# EasyEDA schematic EasyEDA_Source.json
TITLE: Clima; REV: v3.d; Date: 2023.March; Sheet: 1/1; Drawn By: Bryan Costanich; Company: Wilderness Labs
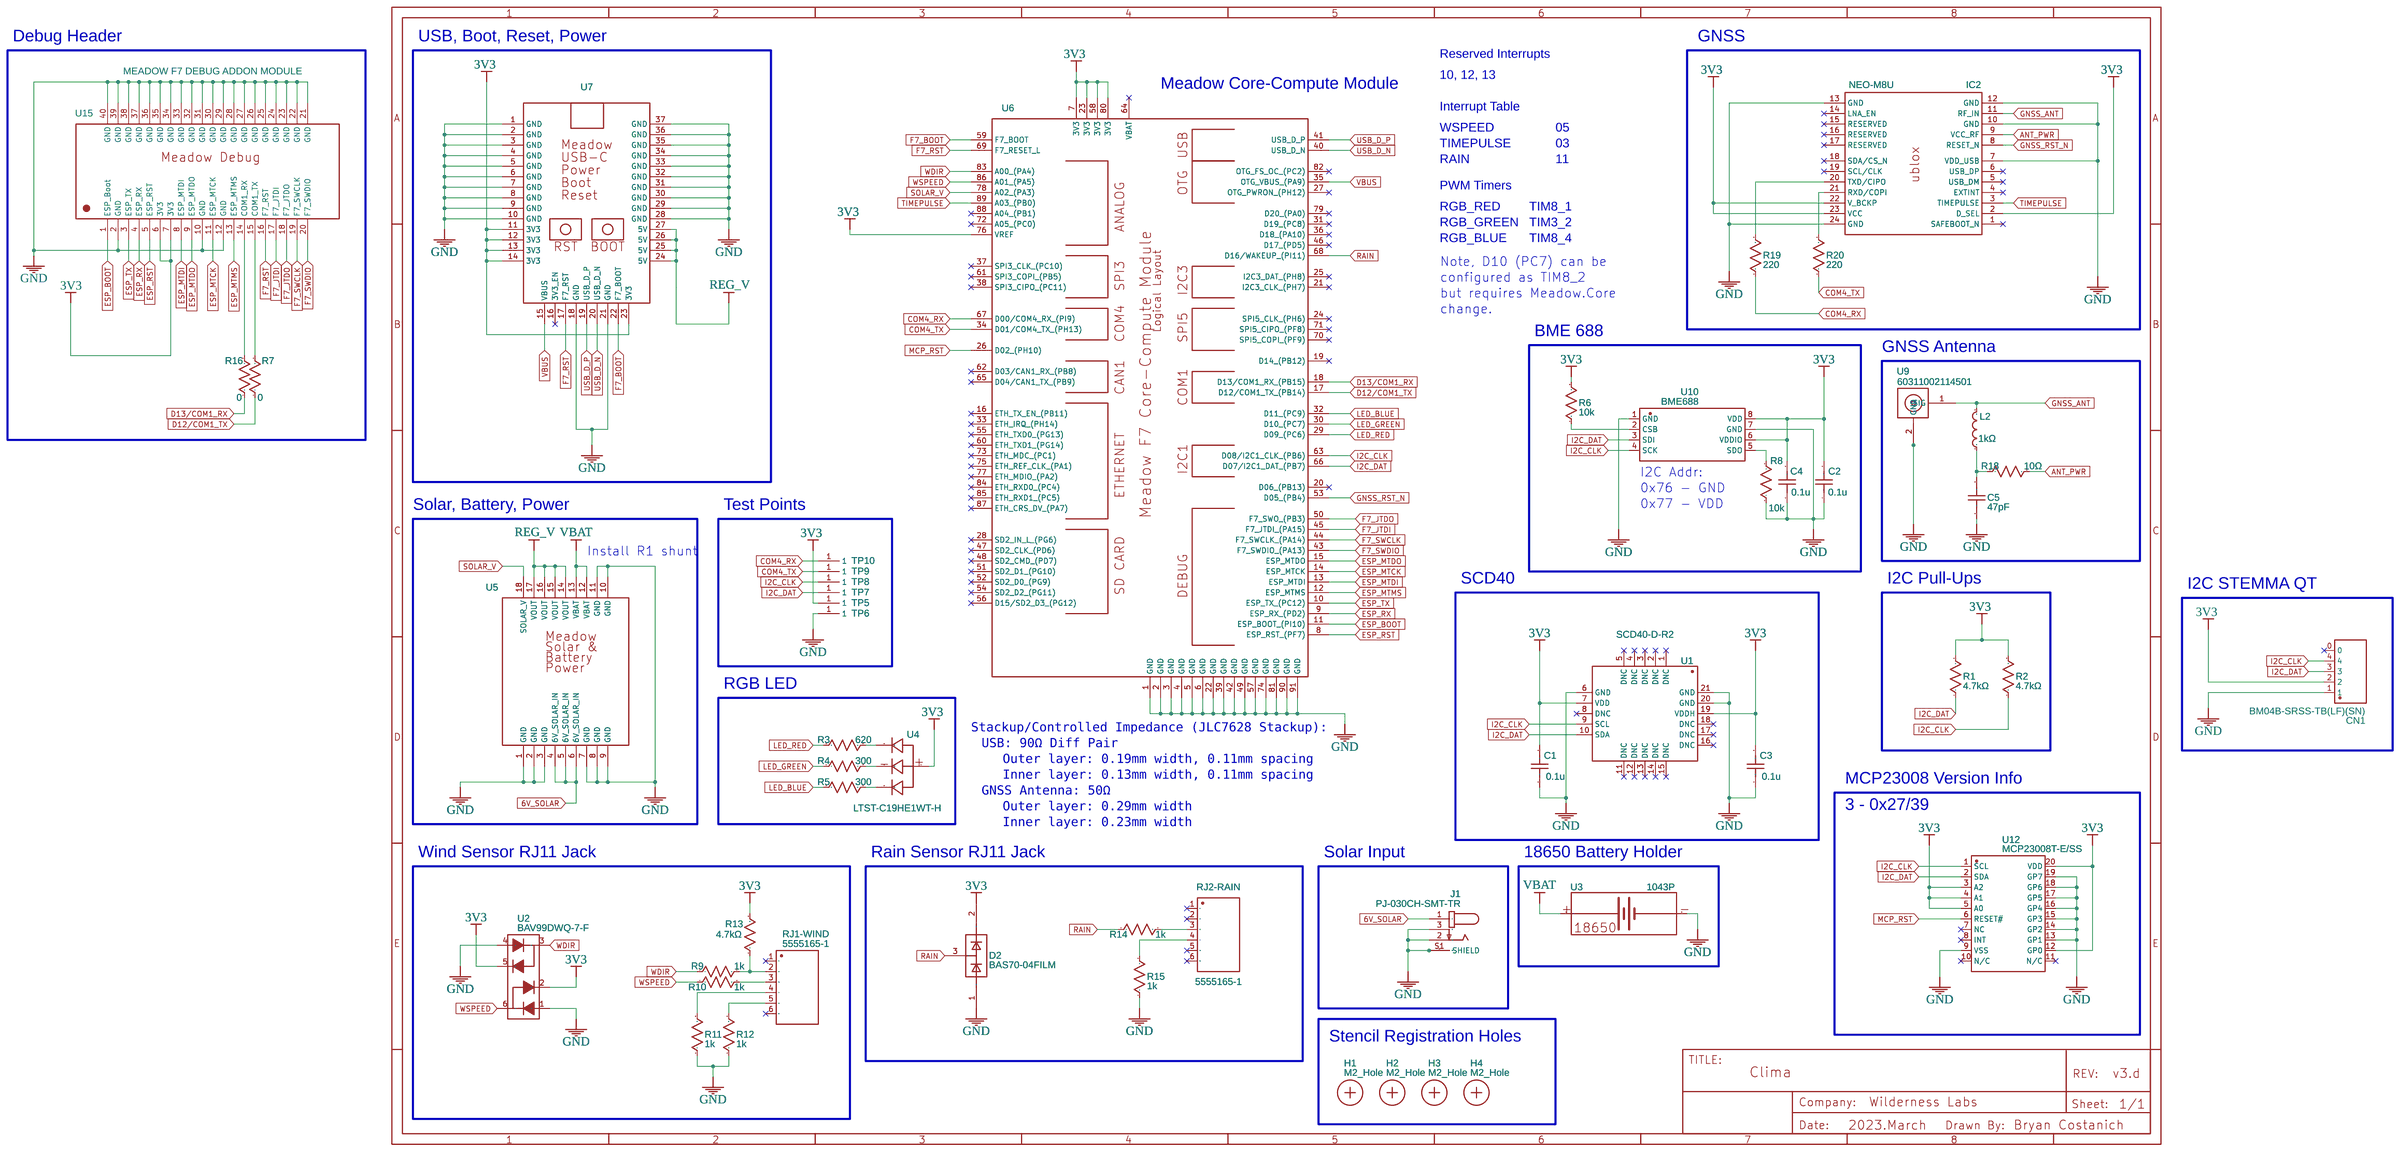
[diagram p0: schematic sheet]

## Parts
C1  0.1u  [C0603]
C2  0.1u  [C0603]
C3  0.1u  [C0603]
C4  0.1u  [C0603]
C5  47pF  [C0603]
CN1  BM04B-SRSS-TB(LF)(SN)  [CONN-SMD_BM04B-SRSS-TB]
D2  BAS70-04FILM  [SOT-23-3_L2.9-W1.3-P1.90-LS2.4-BR]
H1  M2_Hole  [M2_PASTEMASK_STENCIL_REGISTRATION_HOLE]
H2  M2_Hole  [M2_PASTEMASK_STENCIL_REGISTRATION_HOLE]
H3  M2_Hole  [M2_PASTEMASK_STENCIL_REGISTRATION_HOLE]
H4  M2_Hole  [M2_PASTEMASK_STENCIL_REGISTRATION_HOLE]
IC2  NEO-M8U  [NEO-M8U]
J1  PJ-030CH-SMT-TR  [CUI_PJ-030CH-SMT-TR]
L2  1kΩ  [L0402]
R1  4.7kΩ  [R0603]
R2  4.7kΩ  [R0603]
R3  620  [R0603]
R4  300  [R0603]
R5  300  [R0603]
R6  10k  [R0603]
R7  0  [R0603]
R8  10k  [R0603]
R9  1k  [R0603]
R10  1k  [R0603]
R11  1k  [R0603]
R12  1k  [R0603]
R13  4.7kΩ  [R0603]
R14  1k  [R0603]
R15  1k  [R0603]
R16  0  [R0603]
R18  10Ω  [R0603]
R19  220  [R0603]
R20  220  [R0603]
RJ1-WIND  5555165-1  [RJ11-TH_6P-P2.54-S2.54_L18.3-W13.4-EH10.2]
RJ2-RAIN  5555165-1  [RJ11-TH_6P-P2.54-S2.54_L18.3-W13.4-EH10.2]
TP5  TESTPAD_PTH  [TESTPAD_PTH]
TP6  TESTPAD_PTH  [TESTPAD_PTH]
TP7  TESTPAD_PTH  [TESTPAD_PTH]
TP8  TESTPAD_PTH  [TESTPAD_PTH]
TP9  TESTPAD_PTH  [TESTPAD_PTH]
TP10  TESTPAD_PTH  [TESTPAD_PTH]
U1  SCD40-D-R2  [LGA-20_L10.1-W10.1-P1.25-TL]
U2  BAV99DWQ-7-F  [SOT363 (NO POLARITY)]
U3  1043P  [BAT-TH_KEYSTONE-1043P]
U4  LTST-C19HE1WT-H  [LED-ARRAY-SMD_0603-4P-L1.6-W1.6-BL-RD]
U5  Meadow Core-Compute Addon Module - Solar Battery Power  [MEADOW CORE-COMPUTE SOLAR & BATTERY POWER ADDON MODULE]
U6  Meadow F7v2 Core-Compute Module - Logical  [MEADOW_F7V2_CORE_COMPUTE]
U7  Meadow Core-Compute USB-C, Power, Boot, and Reset Addon Module  [MEADOW CORE-COMPUTE USB-C, POWER, BOOT, RESET ADDON MODULE]
U8  WILDERNESS_LABS_LOGO_HORIZONTAL  [WILDERNESS_LABS_LOGO_HORIZONTAL]
U9  60311002114501  [SMA_60311002114501]
U10  BME688  [LGA-8_L3.0-W3.0-P0.80-TR]
U12  MCP23008T-E/SS  [SSOP-20_L7.2-W5.3-P0.65-LS7.8-TL]
U15  MEADOW F7 DEBUG ADDON MODULE  [MEADOW F7 DEBUG ADDON MODULE]

## Library data of the parts
C1-C4 = C_0402_US: Contributor: LCEDA_Lib; Manufacturer Part: CC0603KRX7R9BB103; Manufacturer: Yageo
C5 = C_0402_US: Contributor: LCEDA_Lib; Manufacturer Part: CC0603JRNPO9BN470; Manufacturer: Yageo
CN1 = BM04B-SRSS-TB(LF)(SN): Supplier: LCSC; Supplier Part: C160390; Manufacturer: JST; Contributor: LCSC; JLCPCB Part Class: Extended Part
D2 = BAS70-04FILM: Supplier: LCSC; Supplier Part: C283251; Manufacturer: STMicroelectronics; Contributor: LCSC; SMT Type: Extend; JLCPCB SMD: Yes; LCSC Assembly: Yes
H1-H4 = Stencil_Registration_Hole: Contributor: bryan costanich
IC2 = UBLOX_NEO: Contributor: omega33; Manufacturer: u-blox
J1 = PJ-030CH-SMT-TR: Contributor: rbwilliams; Manufacturer: CUI Devices
L2 = BLM15HD102SN1D: Supplier: LCSC; Manufacturer: MuRata; Supplier Part: C21516; LCSC Assembly: Yes; SMT Type: Extend
R1 R2 R13 = Res_0603(1/10W)_US: Manufacturer Part: RC0603FR-074K7L; Manufacturer: Yageo
R3 = R_0603_US: Contributor: LCEDA_Lib; Manufacturer Part: RC0603FR-07620RL; Manufacturer: Yageo
R4 R5 = R_0603_US: Contributor: LCEDA_Lib; Manufacturer Part: RC0603FR-07300RL; Manufacturer: Yageo
R6 R8 = R_0402_US: Contributor: LCEDA_Lib; Manufacturer Part: RC0603FR-0710KL; Manufacturer: Yageo
R7 R16 = R_0603_US: Contributor: LCEDA_Lib; Manufacturer Part: RC0603JR-070RL; Manufacturer: Yageo
R9-R12 R14 R15 = R_0402_US: Contributor: LCEDA_Lib; Manufacturer Part: RC0603FR-071KL; Manufacturer: Yageo
R18 = R_0402_US: Contributor: LCEDA_Lib; Manufacturer Part: RC0603FR-0710RL; Manufacturer: Yageo
R19 R20 = R_0603_US: Contributor: LCEDA_Lib; Manufacturer Part: RC0603FR-07220RL; Manufacturer: Yageo
RJ1-WIND RJ2-RAIN = 5555165-1: Supplier: LCSC; Supplier Part: C305981; Manufacturer: TE Connectivity; Contributor: LCSC; LCSC Assembly: Yes; SMT Type: Extend
TP5-TP10 = TESTPAD_PTH: Contributor: dembdaoc
U1 = SCD40-D-R2: Supplier: LCSC; Supplier Part: C9900009940; Manufacturer: null; JLCPCB Part Class: Extended Part; Contributor: bryan costanich
U2 = BAV99DWQ-7-F: Manufacturer: Diodes Incorporated; Supplier: Digi-Key; Supplier Part: BAV99DWQ-7-FDITR-ND; link: https://www.diodes.com/part/view/BAV99DWQ; Contributor: bryan_6020
U3 = 1043P: Manufacturer: Keystone; Supplier: Digi-Key; link: https://www.keyelco.com/product.cfm/product_id/13958; Contributor: bryan_6020
U4 = LTST-C19HE1WT-H: Supplier: LCSC; Supplier Part: C427425; Manufacturer: Lite-On; Contributor: LCSC; JLCPCB Part Class: Extended Part
U5 = Meadow Core-Compute Addon Module - Solar Battery Power: Manufacturer: Wilderness Labs; Contributor: bryan_6020
U6 = Meadow F7v2 Core-Compute Module - Logical: Manufacturer: Wilderness Labs; link: https://www.wildernesslabs.co/hardware; Contributor: bryan_6020
U7 = Meadow Core-Compute USB-C, Power, Boot, and Reset Addon Module: Manufacturer: Wilderness Labs; Contributor: bryan_6020
U8 = WILDERNESS_LABS_LOGO_HORIZONTAL: Contributor: bryan costanich
U9 = 60311002114501: Manufacturer: Wurth Elektronik; Supplier: Adafruit; link: https://www.we-online.com/catalog/en/WR-SMA_THT_60311002114501; Contributor: bryan_6020
U10 = BME680: Manufacturer: Bosch Sensortec; Contributor: LCSC; LCSC Assembly: Yes; SMT Type: Extend
U12 = MCP23008T-E/SS: Supplier: LCSC; Supplier Part: C629435; Manufacturer: Microchip Tech; Contributor: LCSC
U15 = MEADOW F7 DEBUG ADDON MODULE: Contributor: bryan_6020

## Nets
3V3: C1.2 C2.2 C3.2 C4.2 CN1.2 D2.2(C) IC2.2(D_SEL) IC2.22(V_BCKP) IC2.23(VCC) R1.2 R2.2 R6.2 R13.2 TP5.1 U1.7(VDD) U1.19(VDDH) U2.2(C1) U2.5(C2) U4.4(A) U6.7(3V3) U6.23(3V3) U6.58(3V3) U6.76(VREF) U6.80(3V3) U7.11(3V3) U7.12(3V3) U7.13(3V3) U7.14(3V3) U7.23(3V3) U10.6(VDDIO) U10.8(VDD) U12.3(A2) U12.4(A1) U12.5(A0) U12.12(GP0) U12.20(VDD) U15.6(3V3) U15.7(3V3)
6V_SOLAR: J1.1 U5.4(6V_SOLAR_IN) U5.5(6V_SOLAR_IN) U5.6(6V_SOLAR_IN)
GND: C1.1 C2.1 C3.1 C4.1 C5.1 CN1.1 D2.1(A) IC2.7(VDD_USB) IC2.10(GND) IC2.12(GND) IC2.13(GND) IC2.24(GND) J1.2 J1.3 J1.S1(SHIELD) J1.S2(SHIELD) R8.1 R11.1 R12.1 R15.1 TP6.1 U1.6(GND) U1.20(GND) U1.21(GND) U2.1(A1) U2.4(A2) U3.2(-) U5.1(GND) U5.2(GND) U5.3(GND) U5.7(GND) U5.8(GND) U5.9(GND) U5.10(GND) U5.11(GND) U6.1(GND) U6.2(GND) U6.3(GND) U6.4(GND) U6.5(GND) U6.6(GND) U6.22(GND) U6.39(GND) U6.42(GND) U6.49(GND) U6.57(GND) U6.74(GND) U6.81(GND) U6.90(GND) U6.91(GND) U7.1(GND) U7.2(GND) U7.3(GND) U7.4(GND) U7.5(GND) U7.6(GND) U7.7(GND) U7.8(GND) U7.9(GND) U7.10(GND) U7.18(GND) U7.21(GND) U7.28(GND) U7.29(GND) U7.30(GND) U7.31(GND) U7.32(GND) U7.33(GND) U7.34(GND) U7.35(GND) U7.36(GND) U7.37(GND) U9.2(GND) U10.1(GND) U10.7(GND) U12.9(VSS) U12.13(GP1) U12.14(GP2) U12.15(GP3) U12.16(GP4) U12.17(GP5) U12.18(GP6) U12.19(GP7) U15.2(GND) U15.10(GND) U15.12(GND) U15.21(GND) U15.22(GND) U15.23(GND) U15.24(GND) U15.25(GND) U15.26(GND) U15.27(GND) U15.28(GND) U15.29(GND) U15.30(GND) U15.31(GND) U15.32(GND) U15.33(GND) U15.34(GND) U15.35(GND) U15.36(GND) U15.37(GND) U15.38(GND) U15.39(GND) U15.40(GND)
VBAT: U3.1(+) U5.12(VBAT) U5.13(VBAT)
VBUS: U6.35(OTG_VBUS (PA9)) U7.15(VBUS)
ANT_PWR: IC2.9(VCC_RF) R18.2
COM4_RX: R19.1 TP10.1 U6.67(D00/COM4_RX (PI9))
COM4_TX: R20.1 TP9.1 U6.34(D01/COM4_TX (PH13))
D12/COM1_TX: R7.1 U6.17(D12/COM1_TX (PB14))
D13/COM1_RX: R16.1 U6.18(D13/COM1_RX (PB15))
ESP_BOOT: U6.11(ESP_BOOT (PI10)) U15.1(ESP_Boot)
ESP_MTCK: U6.14(ESP_MTCK) U15.11(ESP_MTCK)
ESP_MTDI: U6.13(ESP_MTDI) U15.8(ESP_MTDI)
ESP_MTDO: U6.15(ESP_MTDO) U15.9(ESP_MTDO)
ESP_MTMS: U6.12(ESP_MTMS) U15.13(ESP_MTMS)
ESP_RST: U6.8(ESP_RST (PF7)) U15.5(ESP_RST)
ESP_RX: U6.9(ESP_RX (PD2)) U15.4(ESP_RX)
ESP_TX: U6.10(ESP_TX (PC12)) U15.3(ESP_TX)
F7_BOOT: U6.59(F7_BOOT) U7.22(F7_BOOT)
F7_JTDI: U6.45(F7_JTDI (PA15)) U15.17(F7_JTDI)
F7_JTDO: U6.50(F7_SWO (PB3)) U15.18(F7_JTDO)
F7_RST: U6.69(F7_RESET_L) U7.17(F7_RST) U15.16(F7_RST)
F7_SWCLK: U6.44(F7_SWCLK (PA14)) U15.19(F7_SWCLK)
F7_SWDIO: U6.43(F7_SWDIO (PA13)) U15.20(F7_SWDIO)
GNSS_ANT: IC2.11(RF_IN) L2.2 U9.1(SIG)
GNSS_RST_N: IC2.8(RESET_N) U6.53(D05 (PB4))
I2C_CLK: CN1.4 R2.1 TP8.1 U1.9(SCL) U6.63(D08/I2C1_CLK (PB6)) U10.4(SCK) U12.1(SCL)
I2C_DAT: CN1.3 R1.1 TP7.1 U1.10(SDA) U6.66(D07/I2C1_DAT (PB7)) U10.3(SDI) U12.2(SDA)
LED_BLUE: R5.1 U6.32(D11 (PC9))
LED_GREEN: R4.1 U6.30(D10 (PC7))
LED_RED: R3.1 U6.29(D09 (PC6))
MCP_RST: U6.26(D02 (PH10)) U12.6(RESET#)
RAIN: D2.3(A/C) R14.1 U6.68(D16/WAKEUP (PI11))
REG_V: U5.14(VOUT) U5.15(VOUT) U5.16(VOUT) U5.17(VOUT) U7.24(5V) U7.25(5V) U7.26(5V) U7.27(5V)
SOLAR_V: U5.18(SOLAR_V) U6.78(A02 (PA3))
TIMEPULSE: IC2.3(TIMEPULSE) U6.89(A03 (PB0))
USB_D_N: U6.40(USB_D_N) U7.20(USB_D_N)
USB_D_P: U6.41(USB_D_P) U7.19(USB_D_P)
WDIR: R9.1 U2.3(AC2) U6.83(A00 (PA4))
WSPEED: R10.1 U2.6(AC) U6.86(A01 (PA5))
Net-(C5-2): C5.2 L2.1 R18.1
Net-(IC2-20): IC2.20(TXD/CIPO) R19.2
Net-(IC2-21): IC2.21(RXD/COPI) R20.2
Net-(R3-2): R3.2 U4.1(C1)
Net-(R4-2): R4.2 U4.2(C2)
Net-(R5-2): R5.2 U4.3(C3)
Net-(R6-1): R6.1 U10.2(CSB)
Net-(R7-2): R7.2 U15.15(COM1_TX)
Net-(R8-2): R8.2 U10.5(SDO)
Net-(R9-2): R9.2 R13.1 RJ1-WIND.2
Net-(R10-2): R10.2 RJ1-WIND.3
Net-(R11-2): R11.2 RJ1-WIND.4
Net-(R12-2): R12.2 RJ1-WIND.5
Net-(R14-2): R14.2 RJ2-RAIN.3
Net-(R15-2): R15.2 RJ2-RAIN.4
Net-(R16-2): R16.2 U15.14(COM1_RX)

Not connected (* = marked no-connect by the designer): CN1 0*; IC2 1(SAFEBOOT_N)* 4(EXTINT)* 5(USB_DM)* 6(USB_DP)* 14(LNA_EN)* 15(RESERVED)* 16(RESERVED)* 17(RESERVED)* 18(SDA/CS_N)* 19(SCL/CLK)*; RJ1-WIND 1* 6*; RJ2-RAIN 1* 2* 5* 6*; U1 1(DNC)* 2(DNC)* 3(DNC)* 4(DNC)* 5(DNC)* 8(DNC)* 11(DNC)* 12(DNC)* 13(DNC)* 14(DNC)* 15(DNC)* 16(DNC)* 17(DNC)* 18(DNC)*; U6 16(ETH_TX_EN (PB11))* 19(D14 (PB12))* 20(D06 (PB13))* 21(I2C3_CLK (PH7))* 24(SPI5_CLK (PH6))* 25(I2C3_DAT (PH8))* 27(OTG_PWRON (PH12))* 28(SD2_IN_L (PG6))* 31(D19 (PC8))* 33(ETH_IRQ (PH14))* 36(D18 (PA10))* 37(SPI3_CLK (PC10))* 38(SPI3_CIPO (PC11))* 46(D17 (PD5))* 47(SD2_CLK (PD6))* 48(SD2_CMD (PD7))* 51(SD2_D1 (PG10))* 52(SD2_D0 (PG9))* 54(SD2_D2 (PG11))* 55(ETH_TXD0 (PG13))* 56(D15/SD2_D3 (PG12))* 60(ETH_TXD1 (PG14))* 61(SPI3_COPI (PB5))* 62(D03/CAN1_RX (PB8))* 64(VBAT)* 65(D04/CAN1_TX (PB9))* 70(SPI5_COPI (PF9))* 71(SPI5_CIPO (PF8))* 72(A05 (PC0))* 73(ETH_MDC (PC1))* 75(ETH_REF_CLK (PA1))* 77(ETH_MDIO (PA2))* 79(D20 (PA0))* 82(OTG_FS_OC (PC2))* 84(ETH_RXD0 (PC4))* 85(ETH_RXD1 (PC5))* 87(ETH_CRS_DV (PA7))* 88(A04 (PB1))*; U7 16(3V3_EN)*; U12 7(NC)* 8(INT)* 10(N/C)* 11(N/C)*

## Notes on the sheet
- Debug Header
- USB, Boot, Reset, Power
- GNSS
- Reserved Interrupts
- 10, 12, 13
- Meadow Core-Compute Module
- Interrupt Table
- WSPEED
- 05
- TIMEPULSE
- 03
- RAIN
- 11
- PWM Timers
- RGB_RED
- TIM8_1
- RGB_GREEN
- TIM3_2
- RGB_BLUE
- TIM8_4
- Note, D10 (PC7) can be
- configured as TIM8_2
- but requires Meadow.Core
- change.
- BME 688
- GNSS Antenna
- I2C Addr:
- 0x76 - GND
- 0x77 - VDD
- Solar, Battery, Power
- Test Points
- Install R1 shunt
- SCD40
- I2C Pull-Ups
- I2C STEMMA QT
- RGB LED
- Stackup/Controlled Impedance (JLC7628 Stackup):
- USB: 90Ω Diff Pair
- Outer layer: 0.19mm width, 0.11mm spacing
- Inner layer: 0.13mm width, 0.11mm spacing
- MCP23008 Version Info
- GNSS Antenna: 50Ω
- Outer layer: 0.29mm width
- 3 - 0x27/39
- Inner layer: 0.23mm width
- Wind Sensor RJ11 Jack
- Rain Sensor RJ11 Jack
- Solar Input
- 18650 Battery Holder
- Stencil Registration Holes
